# Altium schematic sheet Sheet2.SchDoc
size A4
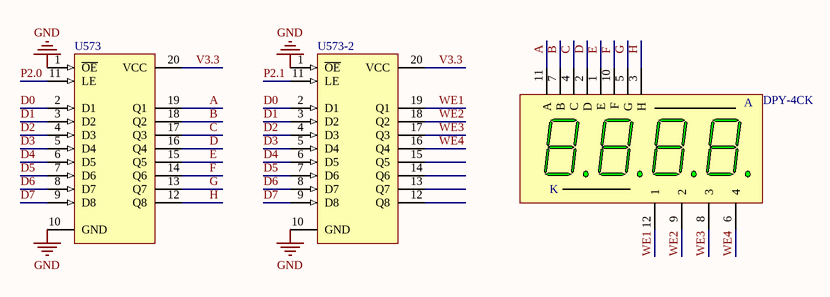
[diagram p0: Sheet2.SchDoc]

## Parts
DPY-4CK  DPY-4CK  [DYP-4BIT]  (value not drawn)
U573  SN74HC573N  [N020D]  (value not drawn)
U573-2  SN74HC573N  [N020D]  (value not drawn)

## Nets
GND: U573.1(~{OE}) U573.10(GND) U573-2.1(~{OE}) U573-2.10(GND)
A: DPY-4CK.11(A) U573.19(Q1)
B: DPY-4CK.7(B) U573.18(Q2)
C: DPY-4CK.4(C) U573.17(Q3)
D: DPY-4CK.2(D) U573.16(Q4)
D0: U573.2(D1) U573-2.2(D1)
D1: U573.3(D2) U573-2.3(D2)
D2: U573.4(D3) U573-2.4(D3)
D3: U573.5(D4) U573-2.5(D4)
D4: U573.6(D5) U573-2.6(D5)
D5: U573.7(D6) U573-2.7(D6)
D6: U573.8(D7) U573-2.8(D7)
D7: U573.9(D8) U573-2.9(D8)
E: DPY-4CK.1(E) U573.15(Q5)
F: DPY-4CK.10(F) U573.14(Q6)
G: DPY-4CK.5(G) U573.13(Q7)
H: DPY-4CK.3(H) U573.12(Q8)
P2.0: U573.11(LE)
P2.1: U573-2.11(LE)
V3.3: U573.20(VCC) U573-2.20(VCC)
WE1: DPY-4CK.12(1) U573-2.19(Q1)
WE2: DPY-4CK.9(2) U573-2.18(Q2)
WE3: DPY-4CK.8(3) U573-2.17(Q3)
WE4: DPY-4CK.6(4) U573-2.16(Q4)

Not connected (* = marked no-connect by the designer): U573-2 12(Q8) 13(Q7) 14(Q6) 15(Q5)

## Notes on the sheet
- (in symbol DPY-4CK) K

## Library data of the parts
DPY-4CK = DPY-4CK: 共阴4位数码管
U573 U573-2 = SN74HC573N: Octal D-Type Transparent Latch with 3-State Outputs; Published: 8-Jun-2000; LatestRevisionDate: 04-Mar-2005; LatestRevisionNote: Stylized 3D Model Added.; DatasheetVersion: Jun-1989; PackageVersion: Oct-1995; PackageReference: N020D; Publisher: Altium Limited; PackageDescription: DIP; 20 Leads; Row Spacing 7.62 mm; Pitch 2.54 mm; ComponentLink1Description: Manufacturer Link; ComponentLink1URL: http://www.ti.com/